# Altium schematic sheet 01-MCU.SchDoc: 手持设备通讯板
size A4; Address1: 张三; Address2: 441521200506202339; Address3: 15812345678; SheetNumber: 7; SheetTotal: 7
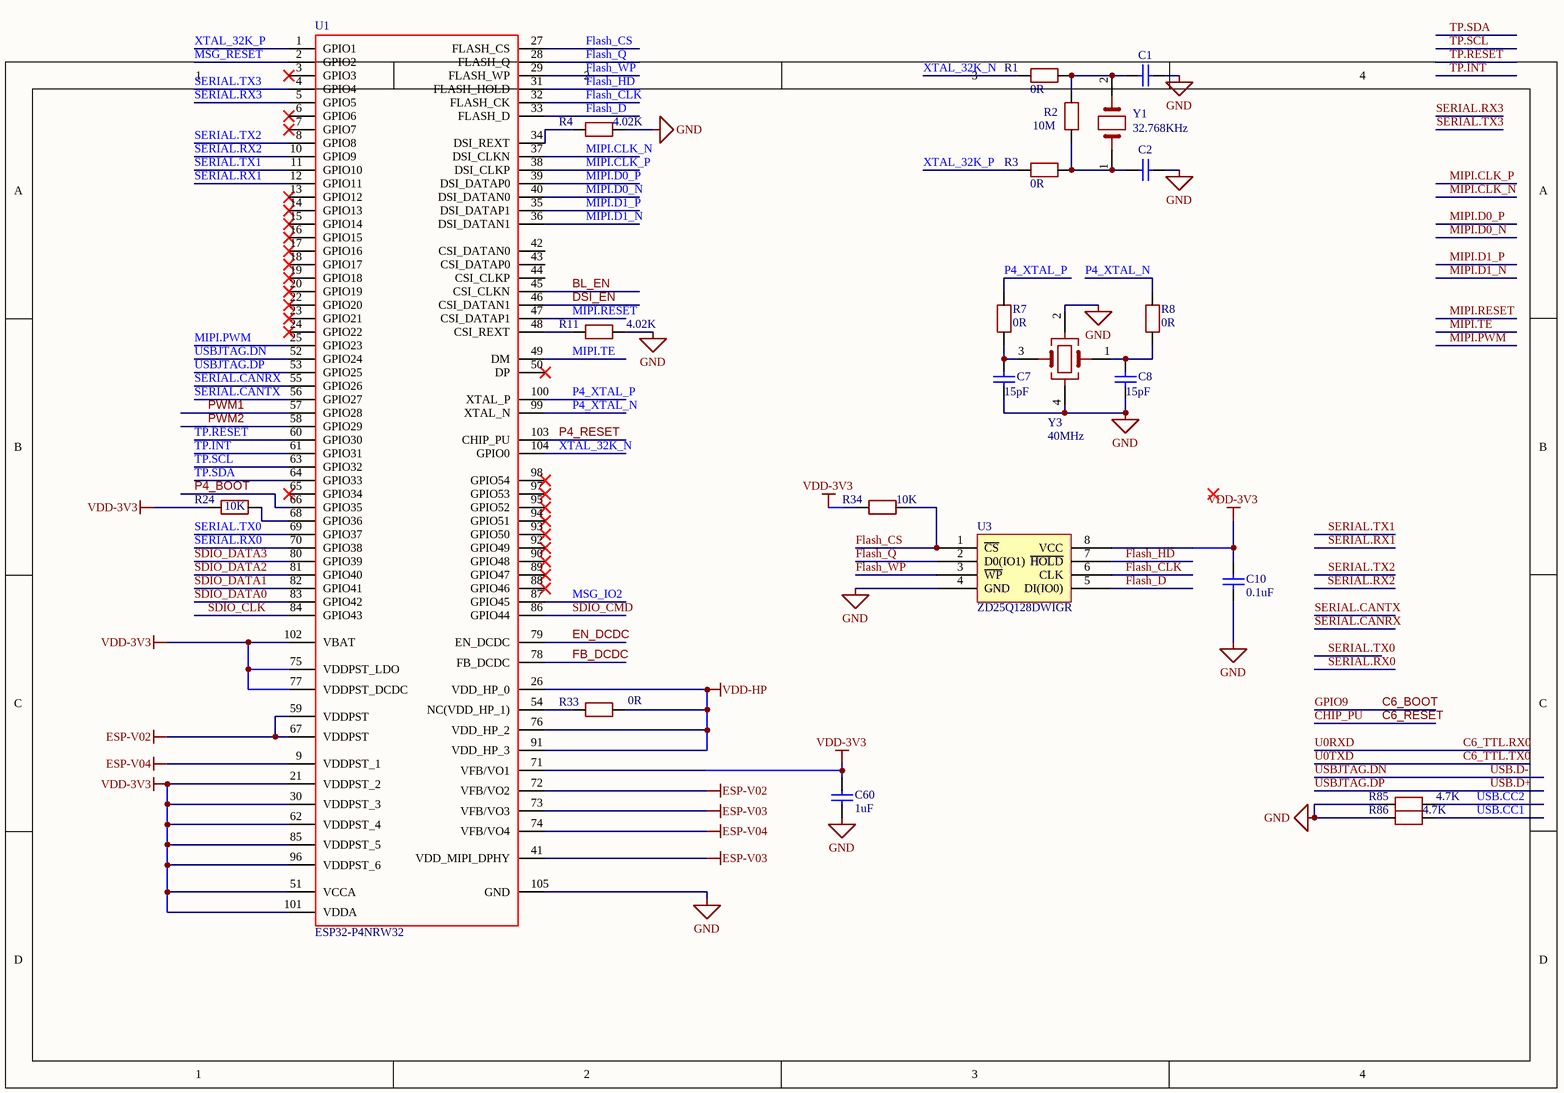
[diagram p0: 01-MCU.SchDoc]

## Parts
C1  12.5pF  [C0402]  (value not drawn)
C2  12.5pF  [C0402]  (value not drawn)
C7  15pF  [C0402]
C8  15pF  [C0402]
C10  0.1uF  [C0402]
C60  1uF  [C0402]
R1  0R  [R0402]
R2  10M  [R0402]
R3  0R  [R0402]
R4  4.02K  [R0402]
R7  0R  [R0402]
R8  0R  [R0402]
R11  4.02K  [R0402]
R24  10K  [R0402]
R33  0R  [R0402]
R34  10K  [R0402]
R85  4.7K  [R0402]
R86  4.7K  [R0402]
U1  ESP32-P4NRW32  [QFN-104_L10.0-W10.0-P0.35-TL-EP7.5]
U3  ZD25Q128DWIGR  [WSON-8_L6.0-W5.0-P1.27-BL-EP]
Y1  32.768KHz  [CRYSTAL-SMD_L3.2-W1.5-1]
Y3  40MHz  [OSC-SMD_4P-L3.2-W2.5-BL_SIT8008BI]

## Nets
ESP-V02: U1.59(VDDPST) U1.67(VDDPST) U1.72(VFB/VO2)
ESP-V03: U1.41(VDD_MIPI_DPHY) U1.73(VFB/VO3)
ESP-V04: U1.9(VDDPST_1) U1.74(VFB/VO4)
GND: C1.1 C2.1 C7.2 C8.2 C10.1 C60.1 R4.2 R11.2 R85.2 R86.2 U1.105(GND) U3.4(GND) Y3.2 Y3.4
VDD-3V3: C10.2 C60.2 R24.1 R34.1 U1.21(VDDPST_2) U1.30(VDDPST_3) U1.51(VCCA) U1.62(VDDPST_4) U1.71(VFB/VO1) U1.75(VDDPST_LDO) U1.77(VDDPST_DCDC) U1.85(VDDPST_5) U1.96(VDDPST_6) U1.101(VDDA) U1.102(VBAT) U3.8(VCC)
VDD-HP: R33.2 U1.26(VDD_HP_0) U1.76(VDD_HP_2) U1.91(VDD_HP_3)
BL_EN: U1.45(CSI_CLKN)
DSI_EN: U1.46(CSI_DATAN1)
EN_DCDC: U1.79(EN_DCDC)
FB_DCDC: U1.78(FB_DCDC)
Flash_CLK: U1.32(FLASH_CK) U3.6(CLK)
Flash_CS: R34.2 U1.27(FLASH_CS) U3.1(~{CS})
Flash_D: U1.33(FLASH_D) U3.5(DI(IO0))
Flash_HD: U1.31(FLASH_HOLD) U3.7(~{HOLD})
Flash_Q: U1.28(FLASH_Q) U3.2(D0(IO1))
Flash_WP: U1.29(FLASH_WP) U3.3(~{WP})
MIPI.CLK_N: U1.37(DSI_CLKN)
MIPI.CLK_P: U1.38(DSI_CLKP)
MIPI.D0_N: U1.40(DSI_DATAN0)
MIPI.D0_P: U1.39(DSI_DATAP0)
MIPI.D1_N: U1.36(DSI_DATAN1)
MIPI.D1_P: U1.35(DSI_DATAP1)
MIPI.PWM: U1.25(GPIO23)
MIPI.RESET: U1.47(CSI_DATAP1)
MIPI.TE: U1.49(DM)
MSG_IO2: U1.87(GPIO45)
MSG_RESET: U1.2(GPIO2)
P4_BOOT: U1.66(GPIO35)
P4_RESET: U1.103(CHIP_PU)
P4_XTAL_N: R8.2 U1.99(XTAL_N)
P4_XTAL_P: R7.2 U1.100(XTAL_P)
PWM1: U1.57(GPIO28)
PWM2: U1.58(GPIO29)
SDIO_CLK: U1.84(GPIO43)
SDIO_CMD: U1.86(GPIO44)
SDIO_DATA0: U1.83(GPIO42)
SDIO_DATA1: U1.82(GPIO41)
SDIO_DATA2: U1.81(GPIO40)
SDIO_DATA3: U1.80(GPIO39)
SERIAL.CANRX: U1.55(GPIO26)
SERIAL.CANTX: U1.56(GPIO27)
SERIAL.RX0: U1.70(GPIO38)
SERIAL.RX1: U1.12(GPIO11)
SERIAL.RX2: U1.10(GPIO9)
SERIAL.RX3: U1.5(GPIO5)
SERIAL.TX0: U1.69(GPIO37)
SERIAL.TX1: U1.11(GPIO10)
SERIAL.TX2: U1.8(GPIO8)
SERIAL.TX3: U1.4(GPIO4)
TP.INT: U1.61(GPIO31)
TP.RESET: U1.60(GPIO30)
TP.SCL: U1.63(GPIO32)
TP.SDA: U1.64(GPIO33)
USB.CC1: R86.1
USB.CC2: R85.1
USB.D+: U1.53(GPIO25)  [also labelled USBJTAG.DP]
USB.D-: U1.52(GPIO24)  [also labelled USBJTAG.DN]
XTAL_32K_N: R1.1 U1.104(GPIO0)
XTAL_32K_P: R3.1 U1.1(GPIO1)
NetC1_2: C1.2 R1.2 R2.2 Y1.2
NetC2_2: C2.2 R2.1 R3.2 Y1.1
NetC7_1: C7.1 R7.1 Y3.3
NetC8_1: C8.1 R8.1 Y3.1
NetR4_1: R4.1 U1.34(DSI_REXT)
NetR11_1: R11.1 U1.48(CSI_REXT)
NetR24_2: R24.2 U1.68(GPIO36)
NetR33_1: R33.1 U1.54(NC(VDD_HP_1))

Not connected (* = marked no-connect by the designer): U1 3(GPIO3)* 6(GPIO6)* 7(GPIO7)* 13(GPIO12)* 14(GPIO13)* 15(GPIO14)* 16(GPIO15)* 17(GPIO16)* 18(GPIO17)* 19(GPIO18)* 20(GPIO19)* 22(GPIO20)* 23(GPIO21)* 24(GPIO22)* 42(CSI_DATAN0) 43(CSI_DATAP0) 44(CSI_CLKP) 50(DP)* 65(GPIO34)* 88(GPIO46)* 89(GPIO47)* 90(GPIO48)* 92(GPIO49)* 93(GPIO50)* 94(GPIO51)* 95(GPIO52)* 97(GPIO53)* 98(GPIO54)*

## Notes on the sheet
- 选手信息
- 图页名称
- 当前日期
- 当前时间
- 项目名称
- 第          幅
- 共          幅

## Library data of the parts
C1 C2 C7 C8 C10 C60 = Capacitor: SimulationGenericComponent: True
  C1 C2: Value: 12.5pF
  C7 C8: Value: 15pF
  C10: Value: 0.1uF
  C60: Value: 1uF
R1-R4 R7 R8 R11 R24 R33 R85 R86 = R
R34 = R?
Y1 = Component_2
Y3 = Component_3